# EAGLE design axiom_beta_plugin_module_1xPMOD (EAGLE 7.0.0)
Assembly variants: Beta
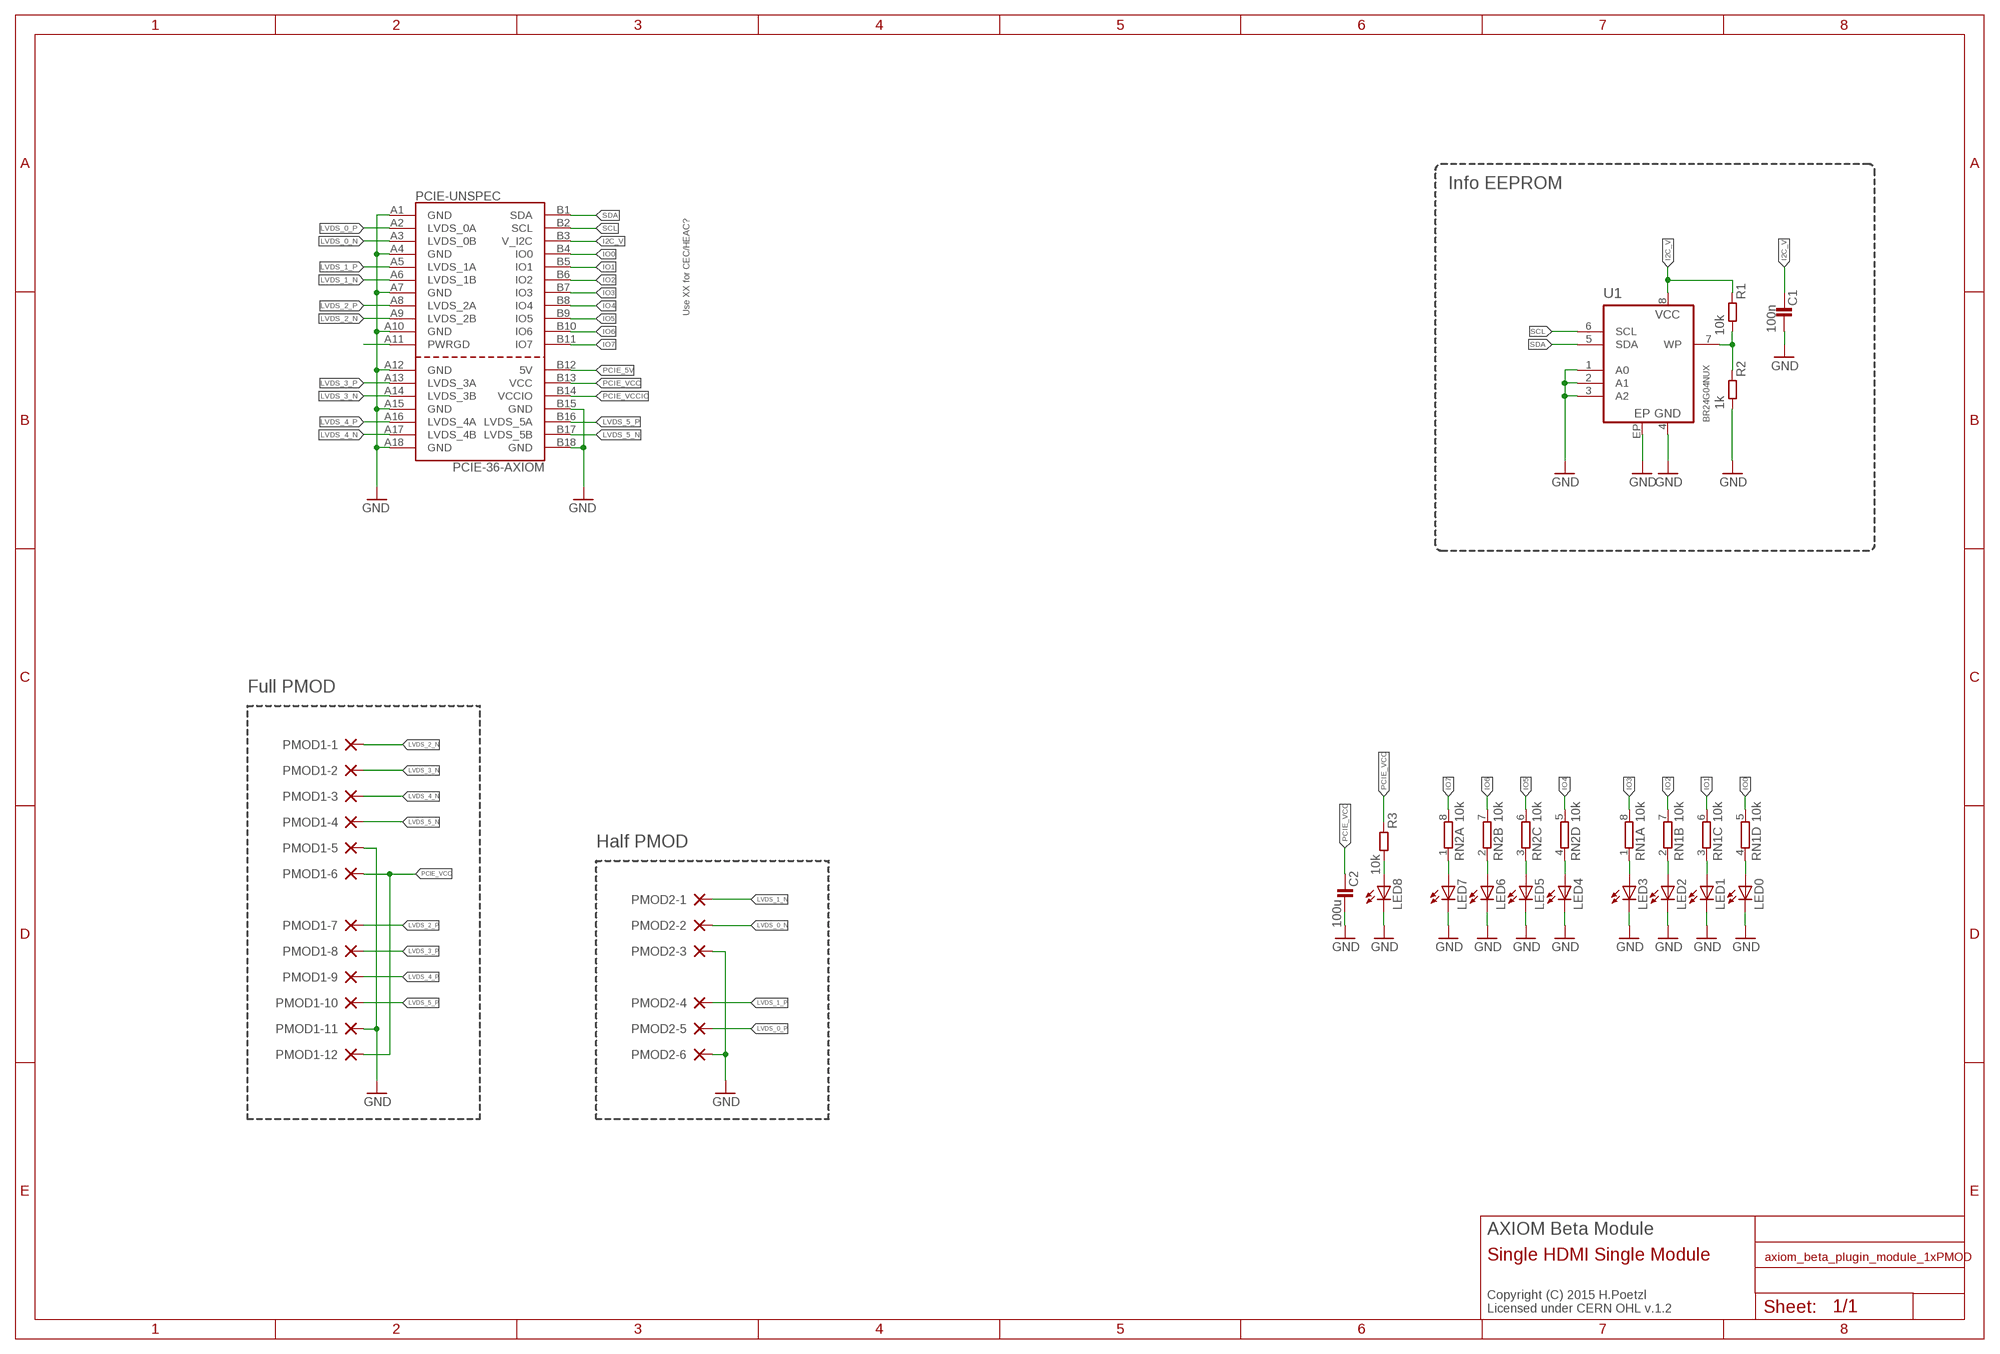
[diagram p0: schematic, sheet 1]

## Parts
C1  100n  C0402-B  [0402-B]
C2  100u  C1206-A  [1206-A]
LED0  LEDCHIPLED_0603  [CHIPLED_0603]
LED1  LEDCHIPLED_0603  [CHIPLED_0603]
LED2  LEDCHIPLED_0603  [CHIPLED_0603]
LED3  LEDCHIPLED_0603  [CHIPLED_0603]
LED4  LEDCHIPLED_0603  [CHIPLED_0603]
LED5  LEDCHIPLED_0603  [CHIPLED_0603]
LED6  LEDCHIPLED_0603  [CHIPLED_0603]
LED7  LEDCHIPLED_0603  [CHIPLED_0603]
LED8  LEDCHIPLED_0603  [CHIPLED_0603]
PCIE-UNSPEC  PCIE-36-AXIOM  [PCIE-36-AXIOM]  (not fitted in variant Beta)
PMOD1-1  SMD-PAD1.6X3.8MM-U  [1.6X3.8U-MM]  (not fitted in variant Beta)
PMOD1-2  SMD-PAD1.6X3.8MM-U  [1.6X3.8U-MM]  (not fitted in variant Beta)
PMOD1-3  SMD-PAD1.6X3.8MM-U  [1.6X3.8U-MM]  (not fitted in variant Beta)
PMOD1-4  SMD-PAD1.6X3.8MM-U  [1.6X3.8U-MM]  (not fitted in variant Beta)
PMOD1-5  SMD-PAD1.6X3.8MM-U  [1.6X3.8U-MM]  (not fitted in variant Beta)
PMOD1-6  SMD-PAD1.6X3.8MM-U  [1.6X3.8U-MM]  (not fitted in variant Beta)
PMOD1-7  SMD-PAD1.6X3.8MM-U  [1.6X3.8U-MM]  (not fitted in variant Beta)
PMOD1-8  SMD-PAD1.6X3.8MM-U  [1.6X3.8U-MM]  (not fitted in variant Beta)
PMOD1-9  SMD-PAD1.6X3.8MM-U  [1.6X3.8U-MM]  (not fitted in variant Beta)
PMOD1-10  SMD-PAD1.6X3.8MM-U  [1.6X3.8U-MM]  (not fitted in variant Beta)
PMOD1-11  SMD-PAD1.6X3.8MM-U  [1.6X3.8U-MM]  (not fitted in variant Beta)
PMOD1-12  SMD-PAD1.6X3.8MM-U  [1.6X3.8U-MM]  (not fitted in variant Beta)
PMOD2-1  SMD-PAD1.6X3.8MM-U  [1.6X3.8U-MM]  (not fitted in variant Beta)
PMOD2-2  SMD-PAD1.6X3.8MM-U  [1.6X3.8U-MM]  (not fitted in variant Beta)
PMOD2-3  SMD-PAD1.6X3.8MM-U  [1.6X3.8U-MM]  (not fitted in variant Beta)
PMOD2-4  SMD-PAD1.6X3.8MM-U  [1.6X3.8U-MM]  (not fitted in variant Beta)
PMOD2-5  SMD-PAD1.6X3.8MM-U  [1.6X3.8U-MM]  (not fitted in variant Beta)
PMOD2-6  SMD-PAD1.6X3.8MM-U  [1.6X3.8U-MM]  (not fitted in variant Beta)
R1  10k  R0402-B  [0402-B]
R2  1k  R0402-B  [0402-B]
R3  10k  R0402-B  [0402-B]
RN1  10k  4R-NCAY16  [CAY16]
RN2  10k  4R-NCAY16  [CAY16]
U1  BR24G04NUX  [DFN200X300X100-9N]

## Nets
GND: C1.2 C2.2 LED0.C LED1.C LED2.C LED3.C LED4.C LED5.C LED6.C LED7.C LED8.C PCIE-UNSPEC.A1(GND) PCIE-UNSPEC.A4(GND) PCIE-UNSPEC.A7(GND) PCIE-UNSPEC.A10(GND) PCIE-UNSPEC.A12(GND) PCIE-UNSPEC.A15(GND) PCIE-UNSPEC.A18(GND) PCIE-UNSPEC.B15(GND) PCIE-UNSPEC.B18(GND) PMOD1-5.1(P) PMOD1-11.1(P) PMOD2-3.1(P) PMOD2-6.1(P) R2.2 U1.1(A0) U1.2(A1) U1.3(A2) U1.4(GND) U1.EP
I2C_V: C1.1 PCIE-UNSPEC.B3(V_I2C) R1.1 U1.8(VCC)
IO0: PCIE-UNSPEC.B4(IO0) RN1.5
IO1: PCIE-UNSPEC.B5(IO1) RN1.6
IO2: PCIE-UNSPEC.B6(IO2) RN1.7
IO3: PCIE-UNSPEC.B7(IO3) RN1.8
IO4: PCIE-UNSPEC.B8(IO4) RN2.5
IO5: PCIE-UNSPEC.B9(IO5) RN2.6
IO6: PCIE-UNSPEC.B10(IO6) RN2.7
IO7: PCIE-UNSPEC.B11(IO7) RN2.8
LVDS_0_N: PCIE-UNSPEC.A3(LVDS_0B) PMOD2-2.1(P)
LVDS_0_P: PCIE-UNSPEC.A2(LVDS_0A) PMOD2-5.1(P)
LVDS_1_N [LVDS]: PCIE-UNSPEC.A6(LVDS_1B) PMOD2-1.1(P)
LVDS_1_P [LVDS]: PCIE-UNSPEC.A5(LVDS_1A) PMOD2-4.1(P)
LVDS_2_N [LVDS]: PCIE-UNSPEC.A9(LVDS_2B) PMOD1-1.1(P)
LVDS_2_P [LVDS]: PCIE-UNSPEC.A8(LVDS_2A) PMOD1-7.1(P)
LVDS_3_N [LVDS]: PCIE-UNSPEC.A14(LVDS_3B) PMOD1-2.1(P)
LVDS_3_P [LVDS]: PCIE-UNSPEC.A13(LVDS_3A) PMOD1-8.1(P)
LVDS_4_N [LVDS]: PCIE-UNSPEC.A17(LVDS_4B) PMOD1-3.1(P)
LVDS_4_P [LVDS]: PCIE-UNSPEC.A16(LVDS_4A) PMOD1-9.1(P)
LVDS_5_N: PCIE-UNSPEC.B17(LVDS_5B) PMOD1-4.1(P)
LVDS_5_P: PCIE-UNSPEC.B16(LVDS_5A) PMOD1-10.1(P)
N$12: R1.2 R2.1 U1.7(WP)
N$196: LED3.A RN1.1
N$197: LED2.A RN1.2
N$198: LED1.A RN1.3
N$202: LED0.A RN1.4
N$209: PCIE-UNSPEC.A11(PWRGD)
N$211: LED8.A R3.2
N$275: LED7.A RN2.1
N$276: LED6.A RN2.2
N$277: LED5.A RN2.3
N$278: LED4.A RN2.4
PCIE_5V: PCIE-UNSPEC.B12(5V)
PCIE_VCC: C2.1 PCIE-UNSPEC.B13(VCC) PMOD1-6.1(P) PMOD1-12.1(P) R3.1
PCIE_VCCIO: PCIE-UNSPEC.B14(VCCIO)
SCL: PCIE-UNSPEC.B2(SCL) U1.6(SCL)
SDA: PCIE-UNSPEC.B1(SDA) U1.5(SDA)

## Notes on the sheet
- Info EEPROM
- Use XX for CEC/HEAC?
- Full PMOD
- Half PMOD
- AXIOM Beta Module
- Single HDMI Single Module
- Copyright (C) 2015 H.Poetzl
  Licensed under CERN OHL v.1.2

## Library data of the parts
C1 C2 = generic-rcl:C
LED0 LED1-LED8 = led:LED: LED OSRAM: - CHIPLED LG R971, LG N971, LY N971, LG Q971, LY Q971, LO R971, LY R971 LH N974, LH R974 LS Q976, LO Q976, LY Q976 LO Q996 - Hyper CHIPLED LW Q18S LB Q993, LB Q99A, LB R99A - SideLED LS A670, LO A670, LY A670, LG A670, LP A670 LB A673, LV A673, LT A673, LW A673 LH A674 LY A675 LS A676, LA A676, LO A676, LY A676, LW A676 LS A679, LY A679, LG A679 - Hyper Micro SIDELED® LS Y876, LA Y876, LO Y876, LY Y876 LT Y87S - SmartLED LW L88C, LW L88S LB L89C, LB L89S, LG L890 LS L89K, LO L89K, LY L89K LS L896, LA L896, LO L896, LY L896 - TOPLED LS T670, LO T670, LY T670, LG T670, LP T670 LSG T670, LSP T670, LSY T670, LOP T670, LYG T670 LG T671, LOG T671, LSG T671 LB T673, LV T673, LT T673, LW T673 LH T674 LS T676, LA T676, LO T676, LY T676, LB T676, LH T676, LSB T676, LW T676 LB T67C, LV T67C, LT T67C, LS T67K, LO T67K, LY T67K, LW E67C LS E67B, LA E67B, LO E67B, LY E67B, LB E67C, LV E67C, LT E67C LW T67C LS T679, LY T679, LG T679 LS T770, LO T770, LY T770, LG T770, LP T770 LB T773, LV T773, LT T773, LW T773 LH T774 LS E675, LA E675, LY E675, LS T675 LS T776, LA T776, LO T776, LY T776, LB T776 LHGB T686 LT T68C, LB T68C - Hyper Mini TOPLED® LB M676 - Mini TOPLED Santana® LG M470 LS M47K, LO M47K, LY M47K Source: http://www.osram.convergy.de LUXEON: - LUMILED® LXK2-PW12-R00, LXK2-PW12-S00, LXK2-PW14-U00, LXK2-PW14-V00 LXK2-PM12-R00, LXK2-PM12-S00, LXK2-PM14-U00 LXK2-PE12-Q00, LXK2-PE12-R00, LXK2-PE12-S00, LXK2-PE14-T00, LXK2-PE14-U00 LXK2-PB12-K00, LXK2-PB12-L00, LXK2-PB12-M00, LXK2-PB14-N00, LXK2-PB14-P00, LXK2-PB14-Q00 LXK2-PR12-L00, LXK2-PR12-M00, LXK2-PR14-Q00, LXK2-PR14-R00 LXK2-PD12-Q00, LXK2-PD12-R00, LXK2-PD12-S00 LXK2-PH12-R00, LXK2-PH12-S00 LXK2-PL12-P00, LXK2-PL12-Q00, LXK2-PL12-R00 Source: www.luxeon.com KINGBRIGHT: KA-3528ASYC Source: www.kingbright.com
PCIE-UNSPEC = PCIe:PCIE-36-AXIOM
PMOD1-1-PMOD1-12 PMOD2-1-PMOD2-6 = smd_pads:SMD-PAD: SMD PAD
R1-R3 = generic-rcl:R
RN1 RN2 = resistor-dil:4R-N: Array Chip Resistor Source: RS Component / Phycomp; OC_FARNELL: unknown; OC_NEWARK: unknown
U1 = eeprom:BR24G04

## Net classes
0 default: width 0.152 mm, drill 0.203 mm
1 LVDS: width 0.152 mm, drill 0.254 mm, clearance 0.152 mm

## Board
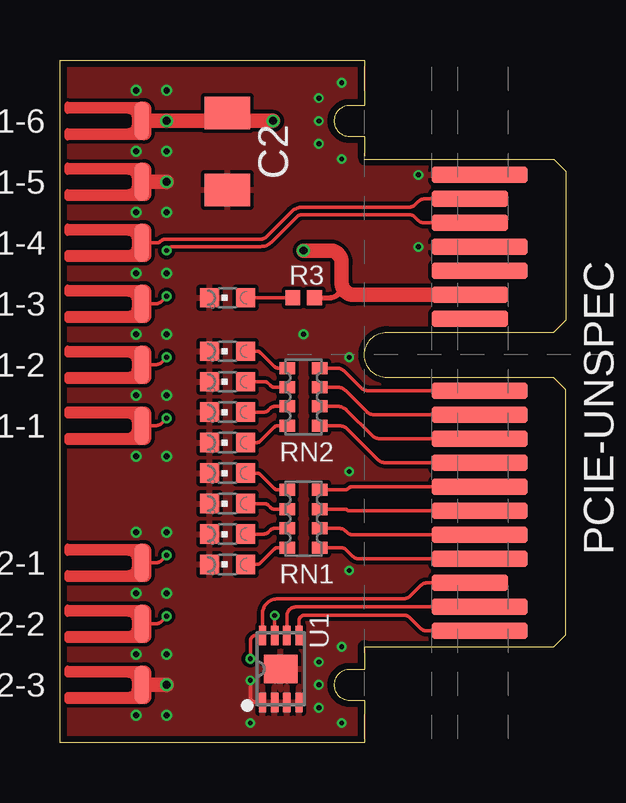
[diagram p1: board, top side]
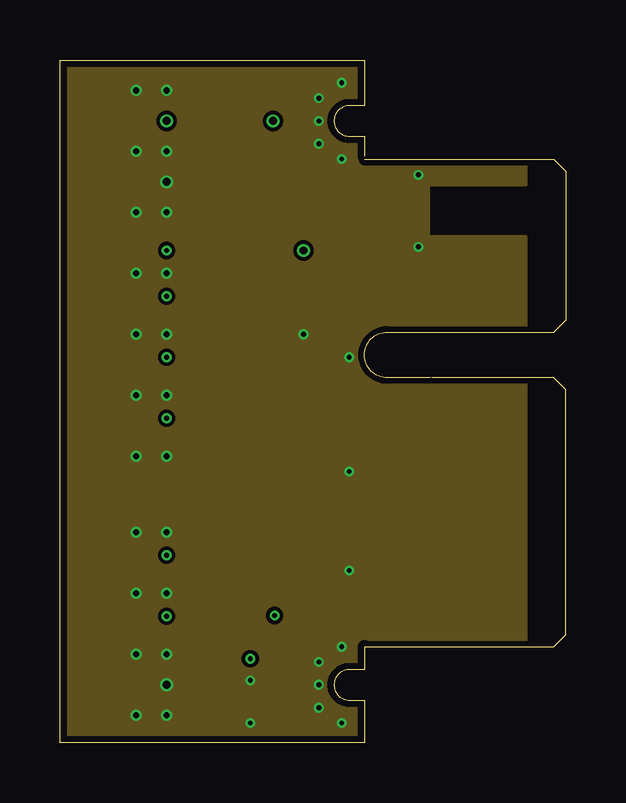
[diagram p2: board, inner layer Route2]
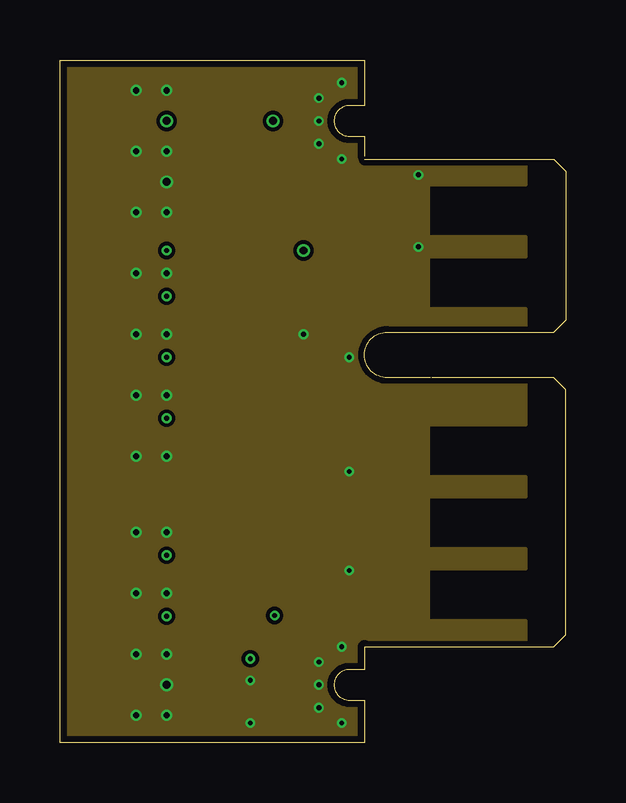
[diagram p3: board, inner layer Route15]
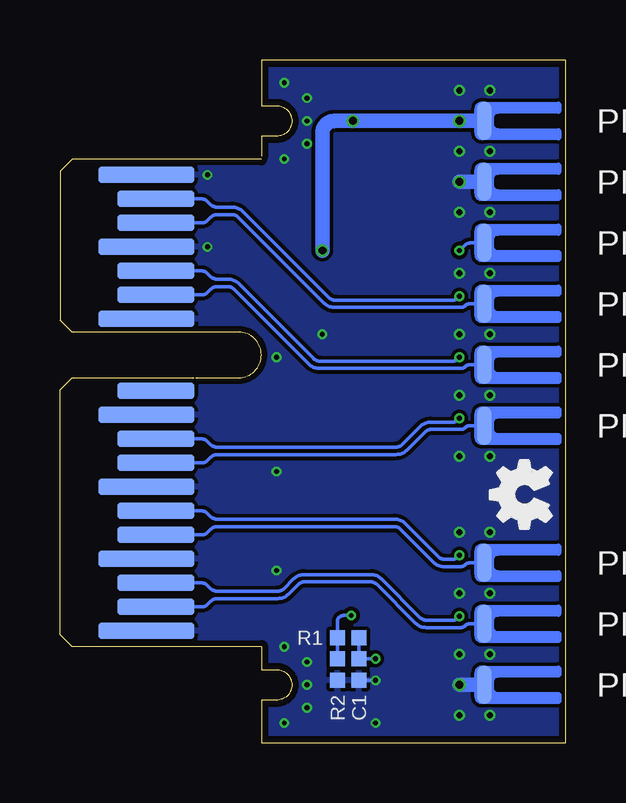
[diagram p4: board, bottom side, seen from below]

Size 21.1 x 28.45 mm. Coordinates in mm from the lower left corner, seen from the top.
Outline: 12.7,24.44 12.7,25.27 12.06,25.27 arc-90 11.43,25.91 arc-90 12.06,26.54 12.7,26.54 12.7,28.45 0,28.45 0,0 12.7,0 12.7,1.78 12.06,1.78 arc-90 11.43,2.41 arc-90 12.06,3.05 12.7,3.05 12.7,4.01
Copper layers (1*2*15*16): Top 0.035559375mm / dielectric 0.17018125mm / Route2 0.01778125mm / dielectric 47mil / Route15 0.01778125mm / dielectric 0.17018125mm / Bottom 0.035559375mm
Design rules "OSHPark-4layer-tuned *": minimum track width 5mil, minimum drill 8mil, track to track 6mil, track to pad 5mil, pad to pad 5mil, via to via 5mil, smd to smd 5mil, copper to edge 10mil, drill to drill 6mil, minimum pad ring 4mil, minimum via ring 4mil, stop-mask expansion 2mil, vias tented up to drill 15mil, thermal gap 6mil
tKeepout: area 10.5,0.8 to 13.7,4; area 10.5,24.3 to 13.7,27.5
bKeepout: area 10.5,0.8 to 13.7,4; area 10.5,24.3 to 13.7,27.5

### Footprints (pad centres in the part's own frame; a part is rotated, then mirrored left to right if it is on the bottom)
0402-B = smd 0.62 x 0.62: 1 -0.45,0; 2 0.45,0
1206-A = smd 1.35 x 1.9: 1 -1.6,0; 2 1.6,0
CHIPLED_0603 = smd 0.8 x 0.8: A 0,-0.75; C 0,0.75
PCIE-36-AXIOM = smd 0.7 x 4 bottom: A1 -11.5,3.6; A4 -8.5,3.6; A7 -5.5,3.6; A10 -2.5,3.6; A12 1.5,3.6; A15 4.5,3.6; A18 7.5,3.6 | smd 0.7 x 3.2 bottom: A2 -10.5,4; A3 -9.5,4; A5 -7.5,4; A6 -6.5,4; A8 -4.5,4; A9 -3.5,4; A11 -1.5,4; A13 2.5,4; A14 3.5,4; A16 5.5,4; A17 6.5,4 | smd 0.7 x 4: B1 -11.5,3.6; B2 -10.5,3.6; B4 -8.5,3.6; B5 -7.5,3.6; B6 -6.5,3.6; B7 -5.5,3.6; B8 -4.5,3.6; B9 -3.5,3.6; B10 -2.5,3.6; B11 -1.5,3.6; B14 3.5,3.6; B15 4.5,3.6; B18 7.5,3.6 | smd 0.7 x 3.2: B3 -9.5,4; B12 1.5,4; B13 2.5,4; B16 5.5,4; B17 6.5,4
1.6X3.8U-MM = smd 1.6 x 0.6: 1 0,-1.5
CAY16 = smd 0.5 x 0.65: 1 -1.2,-0.675; 2 -0.4,-0.675; 3 0.4,-0.675; 4 1.2,-0.675; 5 1.2,0.675; 6 0.4,0.675; 7 -0.4,0.675; 8 -1.2,0.675
DFN200X300X100-9N = smd 0.813 x 0.305: 1 -1.397,0.762; 2 -1.397,0.254; 3 -1.397,-0.254; 4 -1.397,-0.762; 5 1.397,-0.762; 6 1.397,-0.254; 7 1.397,0.254; 8 1.397,0.762 | smd 1.194 x 1.397: EP 0,0

### Placement (x,y rotation side)
C1  8.64,3.05 270 bottom
C2  6.98,24.64 270 top
LED0  6.98,7.43 90 top
LED1  6.98,8.7 90 top
LED2  6.98,9.97 90 top
LED3  6.98,11.24 90 top
LED4  6.98,12.51 90 top
LED5  6.98,13.78 90 top
LED6  6.98,15.05 90 top
LED7  6.98,16.32 90 top
LED8  6.98,18.54 90 top
LOGO1  OSHW_LOGO_FILLX0100-NT  [OSHW_FILLX100_NOTEXT]  32.09,3.21 90 top  (outside the outline)
LOGO2  OSHW_LOGO_FILLX0100-NT  [OSHW_FILLX100_NOTEXT]  0.61,8.93 90 bottom
PCIE-UNSPEC  21.1,16.16 90 top
PMOD1-1  1.9,13.21 90 top
PMOD1-2  1.9,15.75 90 top
PMOD1-3  1.9,18.29 90 top
PMOD1-4  1.9,20.83 90 top
PMOD1-5  1.9,23.37 90 top
PMOD1-6  1.9,25.91 90 top
PMOD1-7  1.9,13.21 270 bottom
PMOD1-8  1.9,15.75 270 bottom
PMOD1-9  1.9,18.29 270 bottom
PMOD1-10  1.9,20.83 270 bottom
PMOD1-11  1.9,23.37 270 bottom
PMOD1-12  1.9,25.91 270 bottom
PMOD2-1  1.9,7.49 90 top
PMOD2-2  1.9,4.95 90 top
PMOD2-3  1.9,2.41 90 top
PMOD2-4  1.9,7.49 270 bottom
PMOD2-5  1.9,4.95 270 bottom
PMOD2-6  1.9,2.41 270 bottom
R1  9.08,4.38 180 bottom
R2  9.52,3.05 270 bottom
R3  10.16,18.54 180 top
RN1  10.16,9.33 270 top
RN2  10.16,14.41 270 top
U1  9.21,3.08 90 top

### Tracks (layer width: path | path; a pad name or v marks a point on that pad's centre or on a via)
GND  (via drill 0.2, 0.25, 0.33)
  Top 0.152: U1.1 8.19,1.68 arc-90 7.94,1.93 v7.94,2.6
  Top 0.61: v4.44,2.41 PMOD2-6.1 | PMOD1-5.1 v4.44,23.37
  Bottom 0.152: v7.94,2.6 C1.2
  Bottom 0.61: PMOD2-6.1 v4.44,2.41 | v4.44,23.37 PMOD1-5.1
  other vias: 11.75,27.5 11.75,0.83 11.75,24.32 7.94,0.83 11.75,4 10.79,24.96 10.79,26.86 10.79,3.37 10.79,1.46 10.79,25.91 10.79,2.41 14.95,23.66 14.95,20.66 4.44,3.68 4.44,6.22 4.44,1.14 4.44,8.76 3.17,3.68 3.17,1.14 3.17,6.22 3.17,8.76 4.44,14.48 4.44,17.02 4.44,11.94 4.44,19.56 4.44,22.1 4.44,24.64 4.44,27.18 3.17,14.48 3.17,11.94 3.17,17.02 3.17,19.56 3.17,22.1 3.17,24.64 3.17,27.18 10.16,17.02 12.06,11.3 12.06,16.07 12.06,7.18
  pour Bottom (isolate 0.127): -0.03,28.45 12.7,28.45 12.7,24.66 15.88,24.66 15.88,3.66 12.7,3.66 12.7,-0.13 -0.03,-0.13
  pour Top (isolate 0.127): -0.03,28.45 12.7,28.45 12.7,24.66 15.88,24.66 15.88,3.66 12.7,3.66 12.7,-0.13 -0.03,-0.13
  pour Route2 (isolate 0.127, rank 3): -0.03,28.45 12.7,28.45 12.7,24.66 19.43,24.66 19.43,23.24 15.37,23.24 15.37,21.08 19.43,21.08 19.43,3.66 12.7,3.66 12.7,-0.13 -0.03,-0.13
  pour Route15 (isolate 0.127, rank 3): -0.03,28.45 12.7,28.45 12.7,24.66 19.43,24.66 19.43,23.24 15.37,23.24 15.37,21.08 19.43,21.08 19.43,20.24 15.37,20.24 15.37,18.08 19.43,18.08 19.43,13.24 15.37,13.24 15.37,11.08 19.43,11.08 19.43,10.24 15.37,10.24 15.37,8.08 19.43,8.08 19.43,7.24 15.37,7.24 15.37,5.08 19.43,5.08 19.43,3.66 12.7,3.66 12.7,-0.13 -0.03,-0.13
I2C_V  (via drill 0.2)
  Top 0.152: v7.94,3.5 7.94,4.22 arc-90 8.19,4.48 U1.8 8.45,5.36 arc-90 9.08,6 14.33,6 arc45 14.6,6.11 15.03,6.55 arc-45 15.3,6.66 PCIE-UNSPEC.B3
  Bottom 0.152: v7.94,3.5 C1.1 R1.1
IO0
  Top 0.152: RN1.5 11.69,8.13 arc-45 11.96,8.02 12.21,7.77 arc45 12.47,7.66 PCIE-UNSPEC.B4
IO1
  Top 0.152: RN1.6 11.65,8.93 arc-45 11.92,8.82 11.97,8.77 arc45 12.24,8.66 PCIE-UNSPEC.B5
IO2
  Top 0.152: RN1.7 11.89,9.73 arc-45 11.98,9.7 arc45 12.07,9.66 PCIE-UNSPEC.B6
IO3
  Top 0.152: RN1.8 10.85,10.55 11.92,10.55 arc45 12.01,10.58 12.05,10.62 arc-45 12.14,10.66 PCIE-UNSPEC.B7
IO4
  Top 0.152: RN2.5 11.63,13.21 arc-45 11.99,13.06 13.25,11.81 arc45 13.61,11.66 PCIE-UNSPEC.B8
IO5
  Top 0.152: RN2.6 11.6,14.01 arc-45 11.96,13.86 13.01,12.81 arc45 13.37,12.66 PCIE-UNSPEC.B9
IO6
  Top 0.152: RN2.7 11.56,14.81 arc-45 11.92,14.66 12.77,13.81 arc45 13.13,13.66 PCIE-UNSPEC.B10
IO7
  Top 0.152: RN2.8 11.52,15.61 arc-45 11.88,15.46 12.53,14.81 arc45 12.89,14.66 PCIE-UNSPEC.B11
LVDS_0_N  (via drill 0.2)
  Top 0.152: v4.44,5.27 4.24,5.06 arc-45 3.97,4.95 PMOD2-2.1
  Bottom 0.152: PCIE-UNSPEC.A3 15.2,6.66 arc45 14.94,6.55 14.81,6.42 arc-45 14.54,6.31 12.03,6.31 arc-45 11.76,6.42 11.36,6.82 arc45 10.91,7.01 8.14,7.01 arc45 7.69,6.82 6.08,5.22 arc-45 5.81,5.11 4.71,5.11 arc-45 4.54,5.18 v4.44,5.27
LVDS_0_P
  Bottom 0.152: PCIE-UNSPEC.A2 15.2,5.66 arc-45 14.94,5.77 14.81,5.9 arc45 14.54,6.01 12.01,6.01 arc-45 11.56,6.19 11.16,6.59 arc45 10.89,6.71 8.16,6.71 arc45 7.89,6.59 6.28,4.99 arc-45 5.83,4.8 4.38,4.8 arc-45 4.21,4.87 4.2,4.88 arc45 4.02,4.95 PMOD2-5.1
LVDS_1_N  (via drill 0.2)
  Top 0.152: v4.44,7.81 4.24,7.6 arc-45 3.97,7.49 PMOD2-1.1
  Bottom 0.152: PCIE-UNSPEC.A6 15.2,9.66 arc45 14.94,9.55 14.81,9.42 arc-45 14.54,9.31 7.14,9.31 arc45 6.69,9.13 5.32,7.76 arc-45 5.06,7.65 4.71,7.65 arc-45 4.54,7.72 v4.44,7.81
LVDS_1_P
  Bottom 0.152: PCIE-UNSPEC.A5 15.2,8.66 arc-45 14.94,8.77 14.81,8.9 arc45 14.54,9.01 7.16,9.01 arc45 6.9,8.9 5.53,7.53 arc-45 5.08,7.34 4.38,7.34 arc-45 4.21,7.41 4.2,7.42 arc45 4.02,7.49 PMOD2-4.1
LVDS_2_N  (via drill 0.2)
  Top 0.152: v4.44,13.53 4.24,13.32 arc-45 3.97,13.21 PMOD1-1.1
  Bottom 0.152: PCIE-UNSPEC.A9 15.2,12.66 arc45 14.94,12.55 14.81,12.42 arc-45 14.54,12.31 7.1,12.31 arc-45 6.83,12.42 6.08,13.17 arc45 5.64,13.36 4.71,13.36 arc-45 4.54,13.43 v4.44,13.53
LVDS_2_P
  Bottom 0.152: PCIE-UNSPEC.A8 15.2,11.66 arc-45 14.94,11.77 14.81,11.9 arc45 14.54,12.01 7.08,12.01 arc-45 6.63,12.19 5.88,12.94 arc45 5.61,13.06 4.38,13.06 arc-45 4.21,13.13 4.2,13.13 arc45 4.02,13.21 PMOD1-7.1
LVDS_3_N  (via drill 0.2)
  Top 0.152: v4.44,16.07 4.24,15.86 arc-45 3.97,15.75 PMOD1-2.1
  Bottom 0.152: PCIE-UNSPEC.A14 15.2,19.66 arc45 14.94,19.55 14.81,19.42 arc-45 14.54,19.31 14.09,19.31 arc45 13.64,19.13 10.53,16.01 arc-45 10.26,15.9 4.71,15.9 arc-45 4.54,15.97 v4.44,16.07
LVDS_3_P
  Bottom 0.152: PCIE-UNSPEC.A13 15.2,18.66 arc-45 14.94,18.77 14.81,18.9 arc45 14.54,19.01 14.11,19.01 arc45 13.84,18.9 10.73,15.78 arc-45 10.28,15.6 4.38,15.6 arc-45 4.21,15.67 4.2,15.67 arc45 4.02,15.75 PMOD1-8.1
LVDS_4_N  (via drill 0.2)
  Top 0.152: 3.17,18.29 PMOD1-3.1 3.97,18.29 arc45 4.24,18.4 v4.44,18.61
  Bottom 0.152: PCIE-UNSPEC.A17 15.2,22.66 arc45 14.94,22.55 14.81,22.42 arc-45 14.54,22.31 13.91,22.31 arc45 13.47,22.13 9.89,18.55 arc-45 9.62,18.44 4.71,18.44 arc-45 4.54,18.51 v4.44,18.61
LVDS_4_P
  Bottom 0.152: 3.17,18.29 PMOD1-9.1 4.02,18.29 arc-45 4.2,18.21 4.21,18.21 arc45 4.38,18.14 9.64,18.14 arc45 10.09,18.32 13.67,21.9 arc-45 13.94,22.01 14.54,22.01 arc-45 14.81,21.9 14.94,21.77 arc45 15.2,21.66 PCIE-UNSPEC.A16
LVDS_5_N
  Top 0.152: 3.17,20.83 PMOD1-4.1 4.02,20.83 arc45 4.2,20.9 4.21,20.91 arc-45 4.38,20.98 8.35,20.98 arc45 8.62,21.09 9.66,22.13 arc-45 10.1,22.31 14.54,22.31 arc45 14.81,22.42 14.94,22.55 arc-45 15.2,22.66 PCIE-UNSPEC.B17
LVDS_5_P  (via drill 0.2)
  Top 0.152: PCIE-UNSPEC.B16 15.2,21.66 arc-45 14.94,21.77 14.81,21.9 arc45 14.54,22.01 10.13,22.01 arc45 9.86,21.9 8.82,20.86 arc-45 8.37,20.68 4.71,20.68 arc45 4.54,20.6 v4.44,20.51
  Bottom 0.152: 3.17,20.83 PMOD1-10.1 3.97,20.83 arc-45 4.24,20.72 v4.44,20.51
N$12  (via drill 0.2)
  Top 0.152: U1.7 v8.95,5.3
  Bottom 0.152: R2.1 R1.2 9.53,5.05 arc90 9.28,5.3 v8.95,5.3
N$196
  Top 0.152: RN1.1 9.1,10.53 arc-45 8.93,10.61 8.37,11.16 arc45 8.19,11.24 LED3.A
N$197
  Top 0.152: RN1.2 8.95,9.73 arc-45 8.77,9.81 8.69,9.89 arc45 8.51,9.97 LED2.A
N$198
  Top 0.152: RN1.3 8.95,8.93 arc45 8.77,8.86 8.69,8.77 arc-45 8.51,8.7 LED1.A
N$202
  Top 0.152: RN1.4 9.1,8.13 arc45 8.93,8.06 8.37,7.5 arc-45 8.19,7.43 LED0.A
N$211
  Top 0.152: LED8.A R3.2
N$275
  Top 0.152: RN2.1 9.1,15.61 arc-45 8.93,15.69 8.37,16.24 arc45 8.19,16.32 LED7.A
N$276
  Top 0.152: RN2.2 8.95,14.81 arc-45 8.77,14.89 8.69,14.97 arc45 8.51,15.05 LED6.A
N$277
  Top 0.152: RN2.3 8.95,14.01 arc45 8.77,13.94 8.69,13.85 arc-45 8.51,13.78 LED5.A
N$278
  Top 0.152: RN2.4 9.1,13.21 arc45 8.93,13.14 8.37,12.58 arc-45 8.19,12.51 LED4.A
PCIE_VCC  (via drill 0.33)
  Top 0.203: R3.1 11.24,18.54 arc90 11.75,19.05 11.75,19.17
  Top 0.61: PMOD1-6.1 v4.44,25.91 6.98,25.91 | PCIE-UNSPEC.B13 12.25,18.66 arc-90 11.75,19.17 11.75,20 arc90 11.24,20.51 v10.16,20.51 | v8.89,25.91 6.98,25.91 | 6.98,25.91 C2.1
  Bottom 0.61: PMOD1-6.1 v4.44,25.91 9.65,25.91 arc-90 10.16,25.4 v10.16,20.51
SCL
  Top 0.152: U1.6 9.46,5.28 arc-90 9.84,5.66 PCIE-UNSPEC.B2
SDA
  Top 0.152: U1.5 9.97,5.07 arc-90 10.22,5.32 14.33,5.32 arc-45 14.6,5.21 15.03,4.77 arc45 15.3,4.66 PCIE-UNSPEC.B1

### Text on the board
tDocu: HIGH SPEED IO
_tSilk: Copyright (C) 2016 Herbert Pötzl / Licensed under CERN OHL v.1.2
_bSilk: V0.1 / R1.0 | Single PMOD / Plugin Module
tEngrave: AXIOM BETA SPM 1xPMOD / TOP SIDE V0.1 R1.0
bEngrave: AXIOM BETA SPM 1xPMOD / BOTTOM SIDE V0.1 R1.0